# EAGLE schematic Ham-Dip (EAGLE 8.2.1)
VCC: 5v
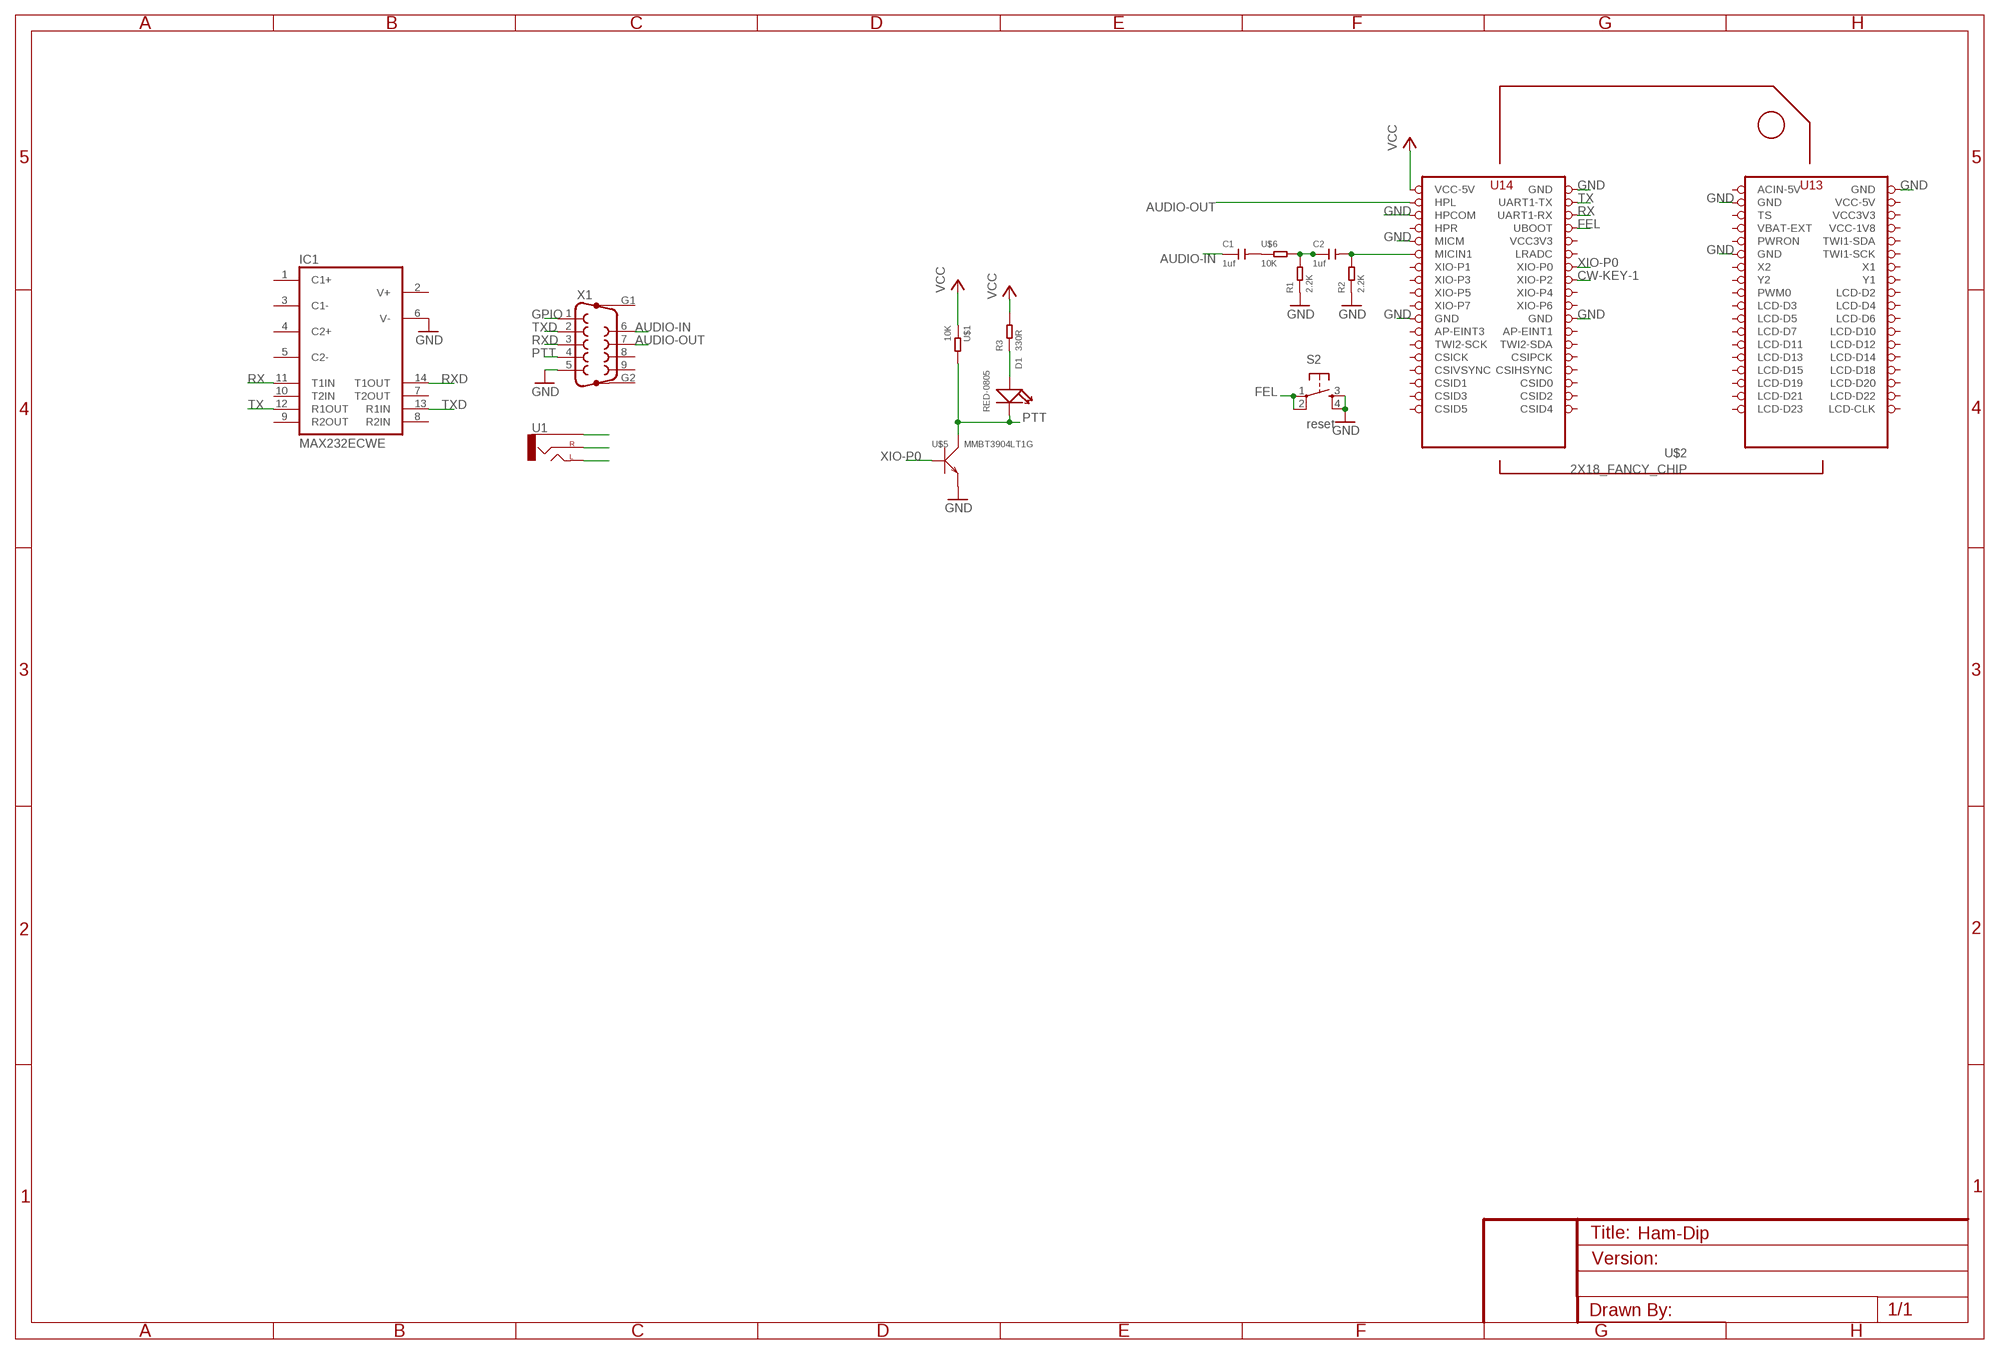
[diagram p0: schematic, sheet 1]

## Parts
C1  1uf  CERAMIC-1UF-25V-10%-X7R(0603)  [C0603]
C2  1uf  CERAMIC-1UF-25V-10%-X7R(0603)  [C0603]
D1  RED-0805  SMD-LED-CLEAR-RED(0805)  [LED-0805]
IC1  MAX232ECWE  [SO16L]
R1  2.2K  SMD-RES-2.2K-5%-1/8W(0805)  [R0805]
R2  2.2K  SMD-RES-2.2K-5%-1/8W(0805)  [R0805]
R3  330R  SMD-RES-220R-5%-1/8W(0805)  [R0805]
S2  reset  TAC_SWITCHSMD  [TACTILE_SWITCH_SMD]
U1  AUDIO-JACKPTH  [AUDIO-JACK]
U$1  10K  SMD-RES-10K-1%-1/8W(0805)  [R0805]
U$2  2X18_FANCY_CHIP  [2X18_FANCY_EDGE_CHIP_TH]
U$5  MMBT3904LT1G  SMD-TRANSISTORS-NPN-40V-200MA-MMBT3904LT1G(SOT-23)  [SOT-23]
U$6  10K  SMD-RES-10K-1%-1/8W(0805)  [R0805]
X1  F09HP  [F09HP]

## Nets
AUDIO-IN: C1.1 X1.6
AUDIO-OUT: U$2.70(HPL) X1.7
CW-KEY-1: U1.RING(RIGHT) U$2.57(XIO-P2)
FEL: S2.1 S2.2 U$2.65(UBOOT)
GND: IC1.6(V-) R1.1 R2.1 S2.3 S2.4 U1.SLEEVE U$2.26(GND) U$2.34(GND) U$2.35(GND) U$2.51(GND) U$2.52(GND) U$2.64(MICM) U$2.68(HPCOM) U$2.71(GND) U$5.2(E) X1.5
GPIO: X1.1
MIC-IN: C2.2 R2.2 U$2.62(MICIN1)
N$1: D1.+ R3.1
N$3: C1.2 U$6.1
N$4: C2.1 R1.2 U$6.2
N$7: U1.TIP(LEFT)
PTT: D1.- U$1.2 U$5.3(C) X1.4
RX: IC1.11(T1IN) U$2.67(UART1-RX)
RXD: IC1.14(T1OUT) X1.3
TX: IC1.12(R1OUT) U$2.69(UART1-TX)
TXD: IC1.13(R1IN) X1.2
VCC: R3.2 U$1.1 U$2.72(VCC-5V)
XIO-P0: U$2.59(XIO-P0) U$5.1(B)
Unconnected: IC1.1(C1+) IC1.2(V+) IC1.3(C1-) IC1.4(C2+) IC1.5(C2-) IC1.7(T2OUT) IC1.8(R2IN) IC1.9(R2OUT) IC1.10(T2IN) U$2.1(LCD-CLK) U$2.2(LCD-D23) U$2.3(LCD-D22) U$2.4(LCD-D21) U$2.5(LCD-D20) U$2.6(LCD-D19) U$2.7(LCD-D18) U$2.8(LCD-D15) U$2.9(LCD-D14) U$2.10(LCD-D13) U$2.11(LCD-D12) U$2.12(LCD-D11) U$2.13(LCD-D10) U$2.14(LCD-D7) U$2.15(LCD-D6) U$2.16(LCD-D5) U$2.17(LCD-D4) U$2.18(LCD-D3) U$2.19(LCD-D2) U$2.20(PWM0) U$2.21(Y1) U$2.22(Y2) U$2.23(X1) U$2.24(X2) U$2.25(TWI1-SCK) U$2.27(TWI1-SDA) U$2.28(PWRON) U$2.30(VBAT-EXT) U$2.32(TS) U$2.36(ACIN-5V) U$2.37(CSID4) U$2.38(CSID5) U$2.39(CSID2) U$2.40(CSID3) U$2.41(CSID0) U$2.42(CSID1) U$2.43(CSIHSYNC) U$2.44(CSIVSYNC) U$2.45(CSIPCK) U$2.46(CSICK) U$2.47(TWI2-SDA) U$2.48(TWI2-SCK) U$2.49(AP-EINT1) U$2.50(AP-EINT3) U$2.53(XIO-P6) U$2.54(XIO-P7) U$2.55(XIO-P4) U$2.56(XIO-P5) U$2.58(XIO-P3) U$2.60(XIO-P1) U$2.61(LRADC) U$2.66(HPR) X1.8 X1.9 X1.G1 X1.G2

## Power pins joined to a net without a drawn wire
GND: IC1.15(GND)
VCC: IC1.16(VCC)
VCC3V3: U$2.31(VCC3V3) U$2.63(VCC3V3)
VCC-1V8: U$2.29(VCC-1V8)
VCC-5V: U$2.33(VCC-5V)

## Library data of the parts
C1 C2 = Seeed-Capacitor-2016:CERAMIC-1UF-25V-10%-X7R(0603): 302010139; MPN: CC0603KRX7R8BB105
D1 = Seeed-LED-2016:SMD-LED-CLEAR-RED(0805): 304090046; MPN: 17-215SURC/S530-A2/TR8
IC1 = maxim:MAX232ECWE: RS232 TRANSCEIVER; MF: MAXIM; MPN: MAX232ECWE+; OC_FARNELL: 9724435; OC_NEWARK: 67K4440
R1 R2 = Seeed-Resistor-2016:SMD-RES-2.2K-5%-1/8W(0805): 301010333; MPN: RC0805JR-072K2L
R3 = Seeed-Resistor-2016:SMD-RES-220R-5%-1/8W(0805): 301010315; MPN: RC0805JR-07220RL; VALUE: 220R
S2 = SparkFun-Electromechanical:TAC_SWITCH: Momentary Switch Button commonly used for reset or general input. Spark Fun Electronics SKU : COM-00097 SMT- SWCH-08247; PROD_ID: SWCH-08247
U1 = SparkFun-Connectors:AUDIO-JACK: 3.5mm Audio Jack Simple 3.5mm common PCB mount audio jack. SKU: PRT-08032
U$1 U$6 = Seeed-Resistor-2016:SMD-RES-10K-1%-1/8W(0805): 301010361; MPN: RC0805FR-0710KL
U$2 = JKW_CHIP:2X18_FANCY_CHIP
U$5 = Seeed-Transistor-2016:SMD-TRANSISTORS-NPN-40V-200MA-MMBT3904LT1G(SOT-23): 305010013; MPN: MMBT3904LT1G
X1 = con-subd:F09HP: SUB-D; OC_FARNELL: unknown; OC_NEWARK: unknown